# Altium schematic sheet input4.SchDoc
size A3
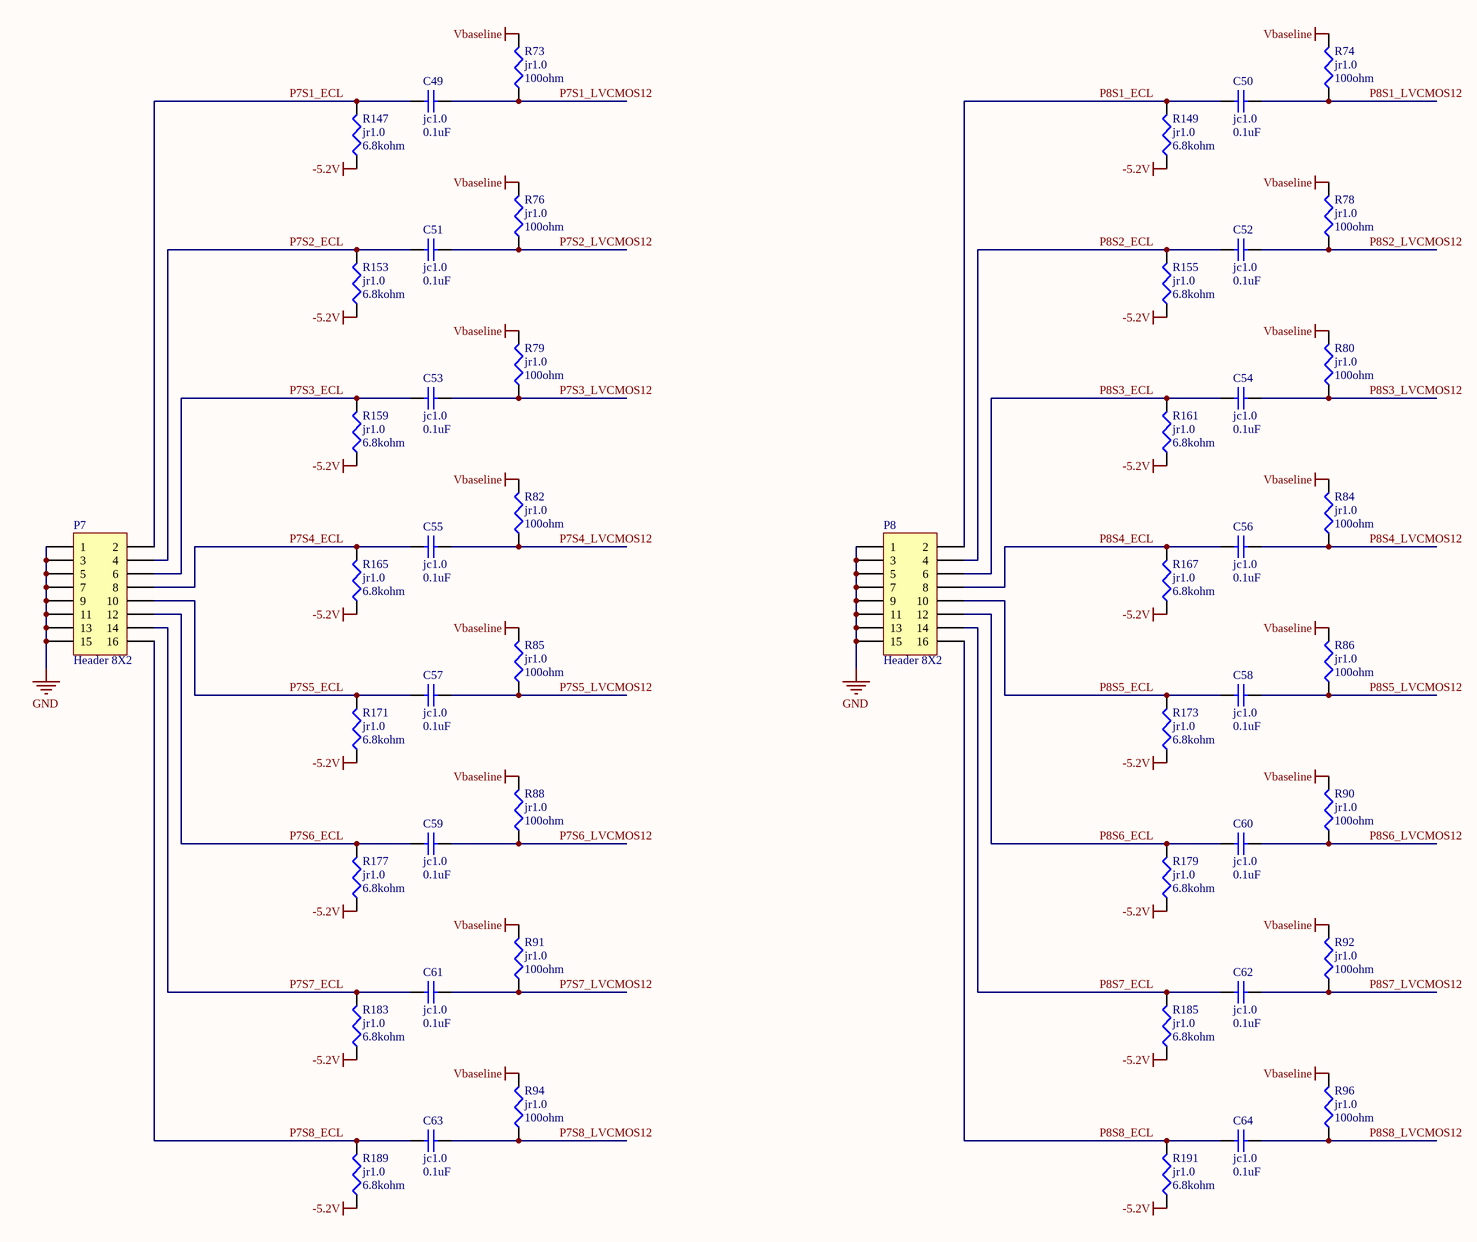
[diagram p0: input4.SchDoc]

## Parts
C49  jc1.0  value 0.1uF  [0402]
C50  jc1.0  value 0.1uF  [0402]
C51  jc1.0  value 0.1uF  [0402]
C52  jc1.0  value 0.1uF  [0402]
C53  jc1.0  value 0.1uF  [0402]
C54  jc1.0  value 0.1uF  [0402]
C55  jc1.0  value 0.1uF  [0402]
C56  jc1.0  value 0.1uF  [0402]
C57  jc1.0  value 0.1uF  [0402]
C58  jc1.0  value 0.1uF  [0402]
C59  jc1.0  value 0.1uF  [0402]
C60  jc1.0  value 0.1uF  [0402]
C61  jc1.0  value 0.1uF  [0402]
C62  jc1.0  value 0.1uF  [0402]
C63  jc1.0  value 0.1uF  [0402]
C64  jc1.0  value 0.1uF  [0402]
P7  Header 8X2  [HDR2X8]
P8  Header 8X2  [HDR2X8]
R73  jr1.0  value 100ohm  [0402]
R74  jr1.0  value 100ohm  [0402]
R76  jr1.0  value 100ohm  [0402]
R78  jr1.0  value 100ohm  [0402]
R79  jr1.0  value 100ohm  [0402]
R80  jr1.0  value 100ohm  [0402]
R82  jr1.0  value 100ohm  [0402]
R84  jr1.0  value 100ohm  [0402]
R85  jr1.0  value 100ohm  [0402]
R86  jr1.0  value 100ohm  [0402]
R88  jr1.0  value 100ohm  [0402]
R90  jr1.0  value 100ohm  [0402]
R91  jr1.0  value 100ohm  [0402]
R92  jr1.0  value 100ohm  [0402]
R94  jr1.0  value 100ohm  [0402]
R96  jr1.0  value 100ohm  [0402]
R147  jr1.0  value 6.8kohm  [0402]
R149  jr1.0  value 6.8kohm  [0402]
R153  jr1.0  value 6.8kohm  [0402]
R155  jr1.0  value 6.8kohm  [0402]
R159  jr1.0  value 6.8kohm  [0402]
R161  jr1.0  value 6.8kohm  [0402]
R165  jr1.0  value 6.8kohm  [0402]
R167  jr1.0  value 6.8kohm  [0402]
R171  jr1.0  value 6.8kohm  [0402]
R173  jr1.0  value 6.8kohm  [0402]
R177  jr1.0  value 6.8kohm  [0402]
R179  jr1.0  value 6.8kohm  [0402]
R183  jr1.0  value 6.8kohm  [0402]
R185  jr1.0  value 6.8kohm  [0402]
R189  jr1.0  value 6.8kohm  [0402]
R191  jr1.0  value 6.8kohm  [0402]

## Nets
-5.2V: R147.1 R149.1 R153.1 R155.1 R159.1 R161.1 R165.1 R167.1 R171.1 R173.1 R177.1 R179.1 R183.1 R185.1 R189.1 R191.1
GND: P7.1 P7.3 P7.5 P7.7 P7.9 P7.11 P7.13 P7.15 P8.1 P8.3 P8.5 P8.7 P8.9 P8.11 P8.13 P8.15
Vbaseline: R73.2 R74.2 R76.2 R78.2 R79.2 R80.2 R82.2 R84.2 R85.2 R86.2 R88.2 R90.2 R91.2 R92.2 R94.2 R96.2
P7S1_ECL: C49.1 P7.2 R147.2
P7S1_LVCMOS12: C49.2 R73.1
P7S2_ECL: C51.1 P7.4 R153.2
P7S2_LVCMOS12: C51.2 R76.1
P7S3_ECL: C53.1 P7.6 R159.2
P7S3_LVCMOS12: C53.2 R79.1
P7S4_ECL: C55.1 P7.8 R165.2
P7S4_LVCMOS12: C55.2 R82.1
P7S5_ECL: C57.1 P7.10 R171.2
P7S5_LVCMOS12: C57.2 R85.1
P7S6_ECL: C59.1 P7.12 R177.2
P7S6_LVCMOS12: C59.2 R88.1
P7S7_ECL: C61.1 P7.14 R183.2
P7S7_LVCMOS12: C61.2 R91.1
P7S8_ECL: C63.1 P7.16 R189.2
P7S8_LVCMOS12: C63.2 R94.1
P8S1_ECL: C50.1 P8.2 R149.2
P8S1_LVCMOS12: C50.2 R74.1
P8S2_ECL: C52.1 P8.4 R155.2
P8S2_LVCMOS12: C52.2 R78.1
P8S3_ECL: C54.1 P8.6 R161.2
P8S3_LVCMOS12: C54.2 R80.1
P8S4_ECL: C56.1 P8.8 R167.2
P8S4_LVCMOS12: C56.2 R84.1
P8S5_ECL: C58.1 P8.10 R173.2
P8S5_LVCMOS12: C58.2 R86.1
P8S6_ECL: C60.1 P8.12 R179.2
P8S6_LVCMOS12: C60.2 R90.1
P8S7_ECL: C62.1 P8.14 R185.2
P8S7_LVCMOS12: C62.2 R92.1
P8S8_ECL: C64.1 P8.16 R191.2
P8S8_LVCMOS12: C64.2 R96.1

## Library data of the parts
C49-C64 = Cap: Capacitor; Published: 8-Jun-2000; LatestRevisionDate: 17-Jul-2002; LatestRevisionNote: Re-released for DXP Platform.; PackageReference: RAD-0.3; Publisher: Altium Limited
P7 P8 = Header 8X2: Header, 8-Pin, Dual row; LatestRevisionDate: 17-Jul-2002; LatestRevisionNote: Re-released for DXP Platform.; Publisher: Altium Limited
R73 R74 R76 R78-R80 R82 R84-R86 R88 R90-R92 R94 R96 R147 R149 R153 R155 R159 R161 R165 R167 R171 R173 R177 R179 R183 R185 R189 R191 = Res: Resistor; Published: 8-Jun-2000; LatestRevisionDate: 04-Mar-2005; LatestRevisionNote: PCB Footprint replaced.; PackageReference: J1-0603; Publisher: Altium Limited